# Altium schematic sheet 0046_PCH STRAPS 2.SchDoc
size A3
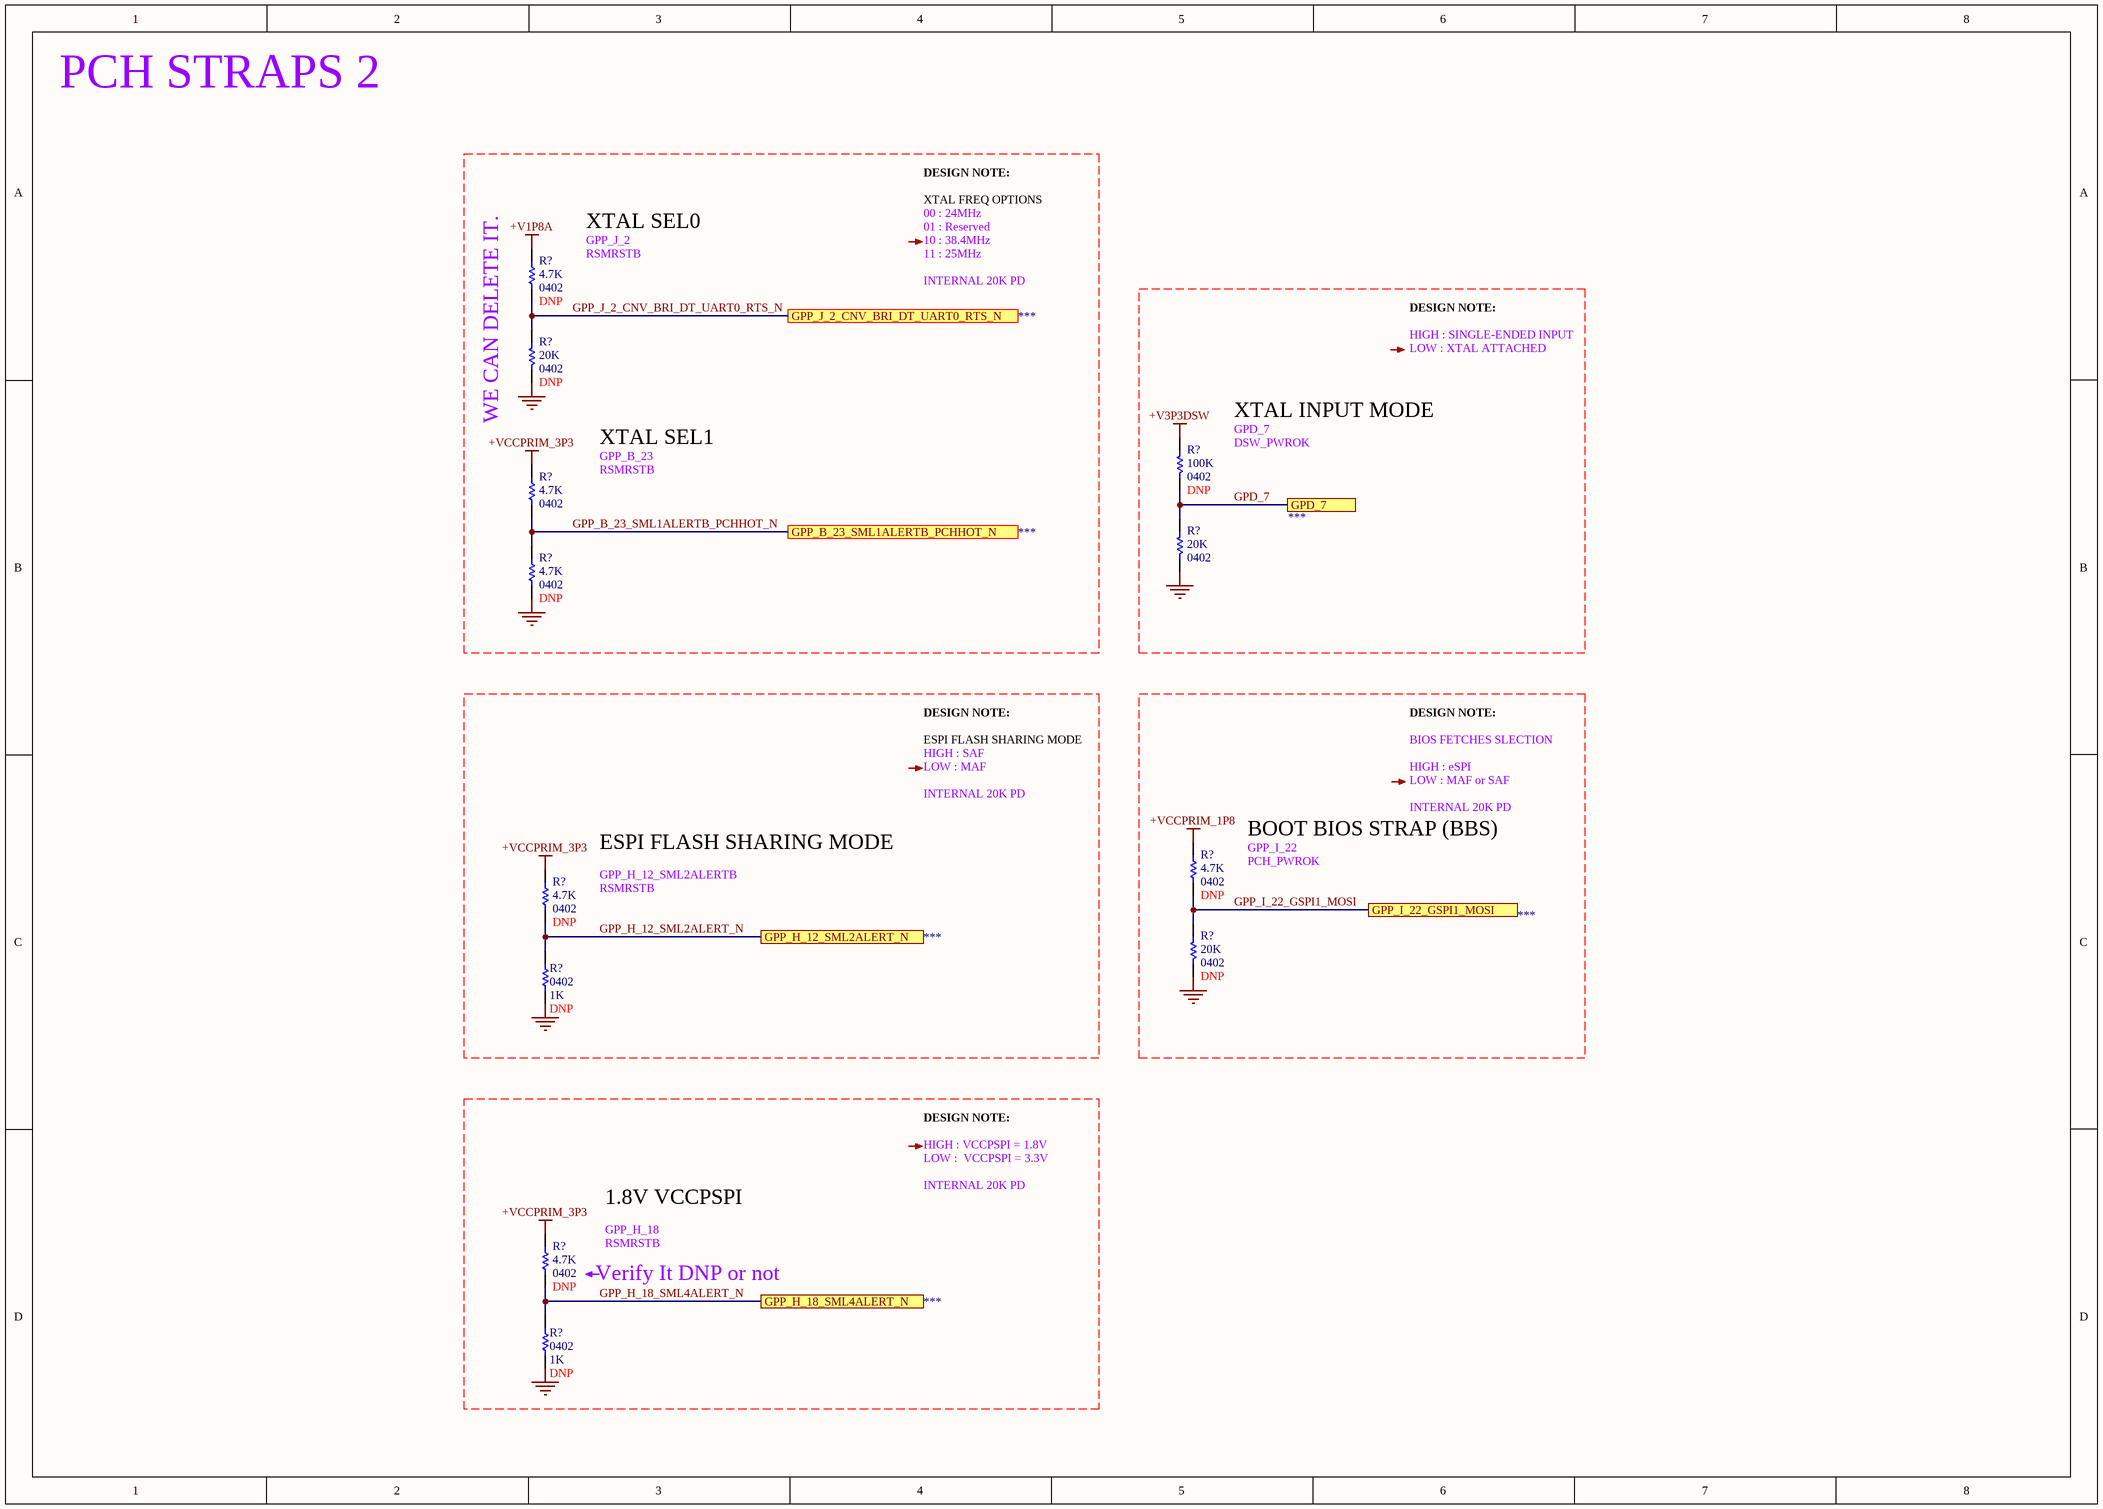
[diagram p0: 0046_PCH STRAPS 2.SchDoc]

## Parts
(Parts that share a designator on the sheet are numbered #1, #2 ... from top to bottom, then left to right.)
R?#1  value 4.7K  Case/Package: 0402  [RESC0402]  (hidden comment: Res)
R?#2  value 20K  Case/Package: 0402  [RESC0402]  (hidden comment: Res)
R?#3  value 100K  Case/Package: 0402  [RESC0402]  (hidden comment: Res)
R?#4  value 4.7K  Case/Package: 0402  [RESC0402]  (hidden comment: Res)
R?#5  value 20K  Case/Package: 0402  [RESC0402]  (hidden comment: Res)
R?#6  value 4.7K  Case/Package: 0402  [RESC0402]  (hidden comment: Res)
R?#7  value 4.7K  Case/Package: 0402  [RESC0402]  (hidden comment: Res)
R?#8  value 4.7K  Case/Package: 0402  [RESC0402]  (hidden comment: Res)
R?#9  value 20K  Case/Package: 0402  [RESC0402]  (hidden comment: Res)
R?#10  value 1K  Case/Package: 0402  [RESC0402]  (hidden comment: Res)
R?#11  value 4.7K  Case/Package: 0402  [RESC0402]  (hidden comment: Res)
R?#12  value 1K  Case/Package: 0402  [RESC0402]  (hidden comment: Res)

## Ports
GPD_7, GPP_B_23_SML1ALERTB_PCHHOT_N, GPP_H_12_SML2ALERT_N, GPP_H_18_SML4ALERT_N, GPP_I_22_GSPI1_MOSI, GPP_J_2_CNV_BRI_DT_UART0_RTS_N

## Nets
+V1P8A: R?#1.2
+V3P3DSW: R?#3.2
+VCCPRIM_1P8: R?#7.2
+VCCPRIM_3P3: R?#4.2 R?#8.2 R?#11.2
GND: R?#2.1 R?#5.1 R?#6.1 R?#9.1 R?#10.1 R?#12.1
GPD_7: R?#3.1 R?#5.2 ; port GPD_7
GPP_B_23_SML1ALERTB_PCHHOT_N: R?#4.1 R?#6.2 ; port GPP_B_23_SML1ALERTB_PCHHOT_N
GPP_H_12_SML2ALERT_N: R?#8.1 R?#10.2 ; port GPP_H_12_SML2ALERT_N
GPP_H_18_SML4ALERT_N: R?#11.1 R?#12.2 ; port GPP_H_18_SML4ALERT_N
GPP_I_22_GSPI1_MOSI: R?#7.1 R?#9.2 ; port GPP_I_22_GSPI1_MOSI
GPP_J_2_CNV_BRI_DT_UART0_RTS_N: R?#1.1 R?#2.2 ; port GPP_J_2_CNV_BRI_DT_UART0_RTS_N

## Notes on the sheet
- PCH STRAPS 2
- DESIGN NOTE:
- GPP_J_2
- XTAL SEL0
- XTAL FREQ OPTIONS
- 10 : 38.4MHz
- 00 : 24MHz
- 01 : Reserved
- RSMRSTB
- INTERNAL 20K PD
- 11 : 25MHz
- LOW : XTAL ATTACHED
- HIGH : SINGLE-ENDED INPUT
- (near R?#1) WE CAN DELETE IT.
- XTAL SEL1
- DSW_PWROK
- GPD_7
- XTAL INPUT MODE
- GPP_B_23
- HIGH : SAF
- LOW : MAF
- ESPI FLASH SHARING MODE
- LOW : MAF or SAF
- BIOS FETCHES SLECTION
- HIGH : eSPI
- BOOT BIOS STRAP (BBS)
- GPP_I_22
- GPP_H_12_SML2ALERTB
- PCH_PWROK
- HIGH : VCCPSPI = 1.8V
- LOW :  VCCPSPI = 3.3V
- GPP_H_18
- 1.8V VCCPSPI
- (near R?#11) Verify It DNP or not

## Library data of the parts
R?#1 R?#4 R?#6-R?#8 R?#11 = Res: Thick Film Resistor -  4.7Kohm, 1%, 0402
  R?#1 R?#6-R?#8 R?#11: DNP: DNP
R?#2 R?#5 R?#9 = Res: Thick Film Resistor -  20Kohm, 1%, 0402
  R?#2 R?#9: DNP: DNP
R?#3 = Res: Thick Film Resistor -  100Kohm, 1%, 0402; DNP: DNP
R?#10 R?#12 = Res: Thick Film Resistor -  1Kohm, 1%, 0402; DNP: DNP